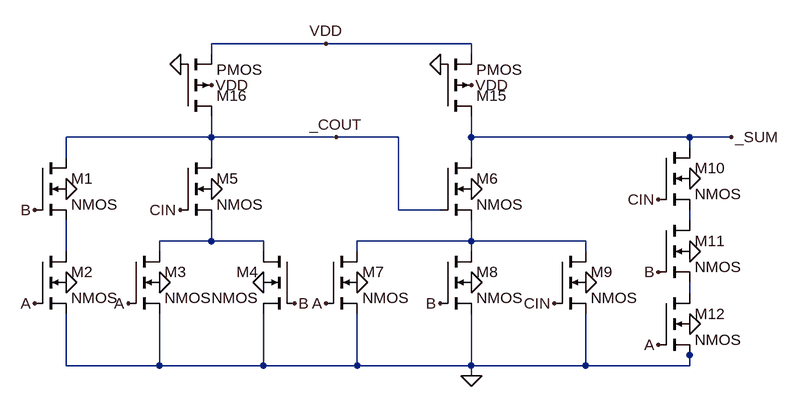
[diagram p0: schematic FA2.asc]
FA2.asc, the LTspice schematic file:
Version 4
SHEET 1 976 680
WIRE -128 -192 -304 -192
WIRE 96 -192 -128 -192
WIRE -304 -176 -304 -192
WIRE 96 -176 96 -192
WIRE -304 -48 -304 -80
WIRE -304 -48 -528 -48
WIRE -112 -48 -304 -48
WIRE -16 -48 -112 -48
WIRE 96 -48 96 -80
WIRE 432 -48 96 -48
WIRE 496 -48 432 -48
WIRE 432 -32 432 -48
WIRE -528 -16 -528 -48
WIRE -304 -16 -304 -48
WIRE 96 -16 96 -48
WIRE -16 64 -16 -48
WIRE 48 64 -16 64
WIRE 432 80 432 64
WIRE -304 112 -304 80
WIRE -304 112 -384 112
WIRE -224 112 -304 112
WIRE 96 112 96 80
WIRE 96 112 -80 112
WIRE 272 112 96 112
WIRE -528 128 -528 80
WIRE -384 128 -384 112
WIRE -224 128 -224 112
WIRE -80 128 -80 112
WIRE 96 128 96 112
WIRE 272 128 272 112
WIRE 432 192 432 176
WIRE 432 288 432 272
WIRE -528 304 -528 224
WIRE -384 304 -384 224
WIRE -384 304 -528 304
WIRE -224 304 -224 224
WIRE -224 304 -384 304
WIRE -80 304 -80 224
WIRE -80 304 -224 304
WIRE 96 304 96 224
WIRE 96 304 -80 304
WIRE 272 304 272 224
WIRE 272 304 96 304
WIRE 432 304 432 288
WIRE 432 304 272 304
WIRE 96 320 96 304
FLAG -576 208 A
FLAG -432 208 A
FLAG -128 208 A
FLAG 384 272 A
FLAG -576 64 B
FLAG -176 208 B
FLAG 48 208 B
FLAG 384 160 B
FLAG -352 64 CIN
FLAG 224 208 CIN
FLAG 384 48 CIN
FLAG -528 176 0
FLAG -528 32 0
FLAG -304 32 0
FLAG -384 176 0
FLAG -224 176 0
FLAG -80 176 0
FLAG 96 32 0
FLAG 272 176 0
FLAG 96 176 0
FLAG 432 240 0
FLAG 432 128 0
FLAG 432 16 0
FLAG 96 320 0
FLAG 48 -160 0
FLAG -352 -160 0
FLAG -128 -192 VDD
FLAG -304 -128 VDD
FLAG 96 -128 VDD
FLAG 496 -48 _SUM
FLAG -112 -48 _COUT
SYMBOL nmos4 -576 -16 R0
SYMATTR InstName M1
SYMBOL nmos4 -576 128 R0
SYMATTR InstName M2
SYMBOL nmos4 -432 128 R0
SYMATTR InstName M3
SYMBOL nmos4 -176 128 M0
SYMATTR InstName M4
SYMBOL nmos4 -352 -16 R0
SYMATTR InstName M5
SYMBOL nmos4 48 -16 R0
SYMATTR InstName M6
SYMBOL nmos4 -128 128 R0
SYMATTR InstName M7
SYMBOL nmos4 48 128 R0
SYMATTR InstName M8
SYMBOL nmos4 224 128 R0
SYMATTR InstName M9
SYMBOL nmos4 384 -32 R0
SYMATTR InstName M10
SYMBOL nmos4 384 80 R0
SYMATTR InstName M11
SYMBOL nmos4 384 192 R0
SYMATTR InstName M12
SYMBOL pmos4 48 -80 M180
SYMATTR InstName M15
SYMBOL pmos4 -352 -80 M180
SYMATTR InstName M16

The netlist it stands for:
* FA2.asc
M1 _COUT B N004 0 NMOS
M2 N004 A 0 0 NMOS
M3 N002 A 0 0 NMOS
M4 N002 B 0 0 NMOS
M5 _COUT CIN N002 0 NMOS
M6 _SUM _COUT N003 0 NMOS
M7 N003 A 0 0 NMOS
M8 N003 B 0 0 NMOS
M9 N003 CIN 0 0 NMOS
M10 _SUM CIN N001 0 NMOS
M11 N001 B N005 0 NMOS
M12 N005 A 0 0 NMOS
M15 _SUM 0 VDD VDD PMOS
M16 _COUT 0 VDD VDD PMOS
.model NMOS NMOS
.model PMOS PMOS
.lib standard.mos
.backanno
.end